# EAGLE schematic akcel (EAGLE 7.7.0)
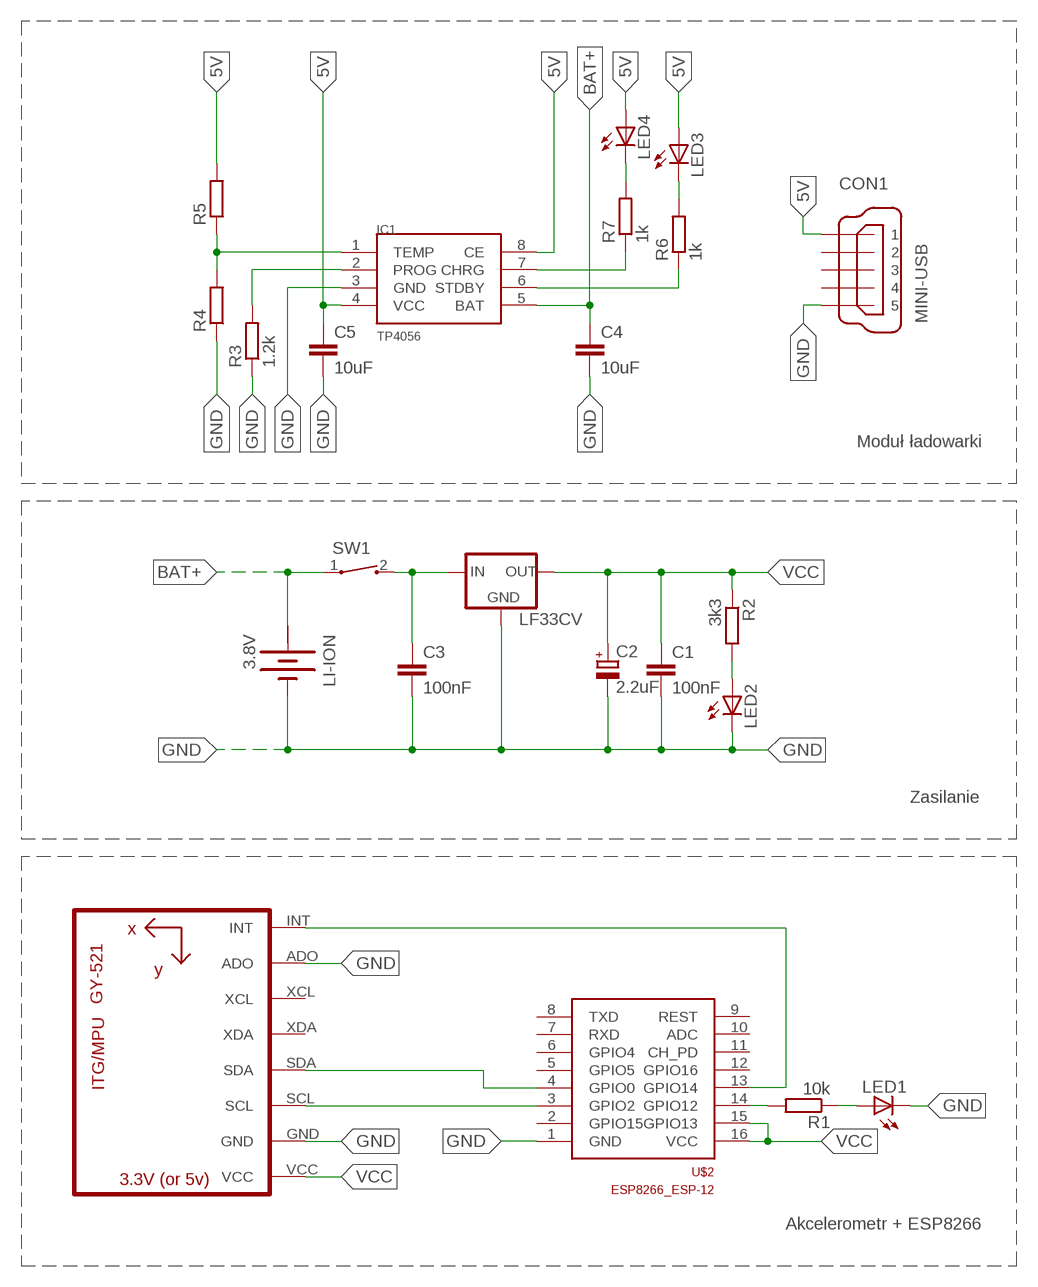
[diagram p0: schematic, sheet 1]

## Parts
C1  100nF  C-EU025-024X044  [C025-024X044]
C2  2.2uF  CPOL-EU085CS-1AR  [085CS_1AR]
C3  100nF  C-EU025-024X044  [C025-024X044]
C4  10uF  C-EU025-024X044  [C025-024X044]
C5  10uF  C-EU025-024X044  [C025-024X044]
CON1  MINI-USB  MINI-USB-32005-201  [32005-201]
IC1  TP4056  [SOP-8]
LED1  LED10MM  [LED10MM]
LED2  LED10MM  [LED10MM]
LED3  LED10MM  [LED10MM]
LED4  LED10MM  [LED10MM]
LF33CV  LFXXCVS  [TO220S]
LI-ION  3.8V  BATTERY  [BATTERY]
R1  10k  R-EU_0204/2V  [0204V]
R2  3k3  R-EU_0204/2V  [0204V]
R3  1.2k  R-EU_0204/2V  [0204V]
R4  R-EU_0204/2V  [0204V]
R5  R-EU_0204/2V  [0204V]
R6  1k  R-EU_0204/2V  [0204V]
R7  1k  R-EU_0204/2V  [0204V]
SW1  CT10-XXXX-A2  [CT10-XXXX-A2]
U1  GY-521MPU6050  [GY-521]
U$2  ESP8266_ESP-12  [ESP8266-ESP12]

## Nets
5V: C5.1 CON1.1 IC1.4(VCC) IC1.8(CE) LED3.A LED4.A R5.2
BAT+: C4.1 IC1.5(BAT) LI-ION.+ SW1.1
GND: C1.2 C2.- C3.2 C4.2 C5.2 CON1.5 IC1.3(GND) LED1.K(C) LED2.K(C) LF33CV.2(GND) LI-ION.- R3.1 R4.1 U1.ADO U1.GND U$2.1(GND)
N$1: U1.SCL U$2.3(GPIO2)
N$2: U1.SDA U$2.4(GPIO0)
N$3: IC1.1(TEMP) R4.2 R5.1
N$4: U1.INT U$2.13(GPIO14)
N$5: IC1.6(STDBY) R6.1
N$6: LED3.K(C) R6.2
N$7: R1.2 U$2.14(GPIO12)
N$8: LED1.A R1.1
N$9: C3.1 LF33CV.1(IN) SW1.2
N$11: LED2.A R2.2
N$12: IC1.7(CHRG) R7.1
N$13: LED4.K(C) R7.2
N$18: IC1.2(PROG) R3.2
VCC: C1.1 C2.+ LF33CV.3(OUT) R2.1 U1.VCC U$2.15(GPIO13) U$2.16(VCC)
Unconnected: CON1.2 CON1.3 CON1.4 U1.XCL U1.XDA U$2.2(GPIO15) U$2.5(GPIO5) U$2.6(GPIO4) U$2.7(RXD) U$2.8(TXD) U$2.9(REST) U$2.10(ADC) U$2.11(CH_PD) U$2.12(GPIO16)

## Notes on the sheet
- Moduł ładowarki
- Zasilanie
- Akcelerometr + ESP8266

## Power pins joined to a net without a drawn wire
+: LI-ION.+@1(+)

## Library data of the parts
C1 C3-C5 = rcl:C-EU: CAPACITOR, European symbol
C2 = rcl:CPOL-EU: POLARIZED CAPACITOR, European symbol
CON1 = con-cypressindustries:MINI-USB-: MINI USB-B Conector Source: www.cypressindustries.com; OC_FARNELL: unknown; OC_NEWARK: unknown
IC1 = TP4056:TP4056
LED1-LED4 = led:LED: LED OSRAM: - CHIPLED LG R971, LG N971, LY N971, LG Q971, LY Q971, LO R971, LY R971 LH N974, LH R974 LS Q976, LO Q976, LY Q976 LO Q996 - Hyper CHIPLED LW Q18S LB Q993, LB Q99A, LB R99A - SideLED LS A670, LO A670, LY A670, LG A670, LP A670 LB A673, LV A673, LT A673, LW A673 LH A674 LY A675 LS A676, LA A676, LO A676, LY A676, LW A676 LS A679, LY A679, LG A679 - Hyper Micro SIDELED® LS Y876, LA Y876, LO Y876, LY Y876 LT Y87S - SmartLED LW L88C, LW L88S LB L89C, LB L89S, LG L890 LS L89K, LO L89K, LY L89K LS L896, LA L896, LO L896, LY L896 - TOPLED LS T670, LO T670, LY T670, LG T670, LP T670 LSG T670, LSP T670, LSY T670, LOP T670, LYG T670 LG T671, LOG T671, LSG T671 LB T673, LV T673, LT T673, LW T673 LH T674 LS T676, LA T676, LO T676, LY T676, LB T676, LH T676, LSB T676, LW T676 LB T67C, LV T67C, LT T67C, LS T67K, LO T67K, LY T67K, LW E67C LS E67B, LA E67B, LO E67B, LY E67B, LB E67C, LV E67C, LT E67C LW T67C LS T679, LY T679, LG T679 LS T770, LO T770, LY T770, LG T770, LP T770 LB T773, LV T773, LT T773, LW T773 LH T774 LS E675, LA E675, LY E675, LS T675 LS T776, LA T776, LO T776, LY T776, LB T776 LHGB T686 LT T68C, LB T68C - Hyper Mini TOPLED® LB M676 - Mini TOPLED Santana® LG M470 LS M47K, LO M47K, LY M47K Source: http://www.osram.convergy.de LUXEON: - LUMILED® LXK2-PW12-R00, LXK2-PW12-S00, LXK2-PW14-U00, LXK2-PW14-V00 LXK2-PM12-R00, LXK2-PM12-S00, LXK2-PM14-U00 LXK2-PE12-Q00, LXK2-PE12-R00, LXK2-PE12-S00, LXK2-PE14-T00, LXK2-PE14-U00 LXK2-PB12-K00, LXK2-PB12-L00, LXK2-PB12-M00, LXK2-PB14-N00, LXK2-PB14-P00, LXK2-PB14-Q00 LXK2-PR12-L00, LXK2-PR12-M00, LXK2-PR14-Q00, LXK2-PR14-R00 LXK2-PD12-Q00, LXK2-PD12-R00, LXK2-PD12-S00 LXK2-PH12-R00, LXK2-PH12-S00 LXK2-PL12-P00, LXK2-PL12-Q00, LXK2-PL12-R00 Source: www.luxeon.com KINGBRIGHT: KA-3528ASYC Source: www.kingbright.com
LF33CV = lf33:LFXXCV: VOLTAGE REGULATOR
LI-ION = special:BATTERY: BATTERY
R1-R7 = rcl:R-EU_: RESISTOR, European symbol
SW1 = switch-coto:CT10-XXXX-: CT10 Series Molded Switch Source: www.cotorelay.com .. Coto_Technology__CT10-1530-G1.pdf
U1 = gy-521:GY-521
U$2 = esp8266-12:ESP8266_ESP-12